# Altium schematic sheet Sheet2.SchDoc
size A4; SheetNumber: 2; SheetTotal: 3
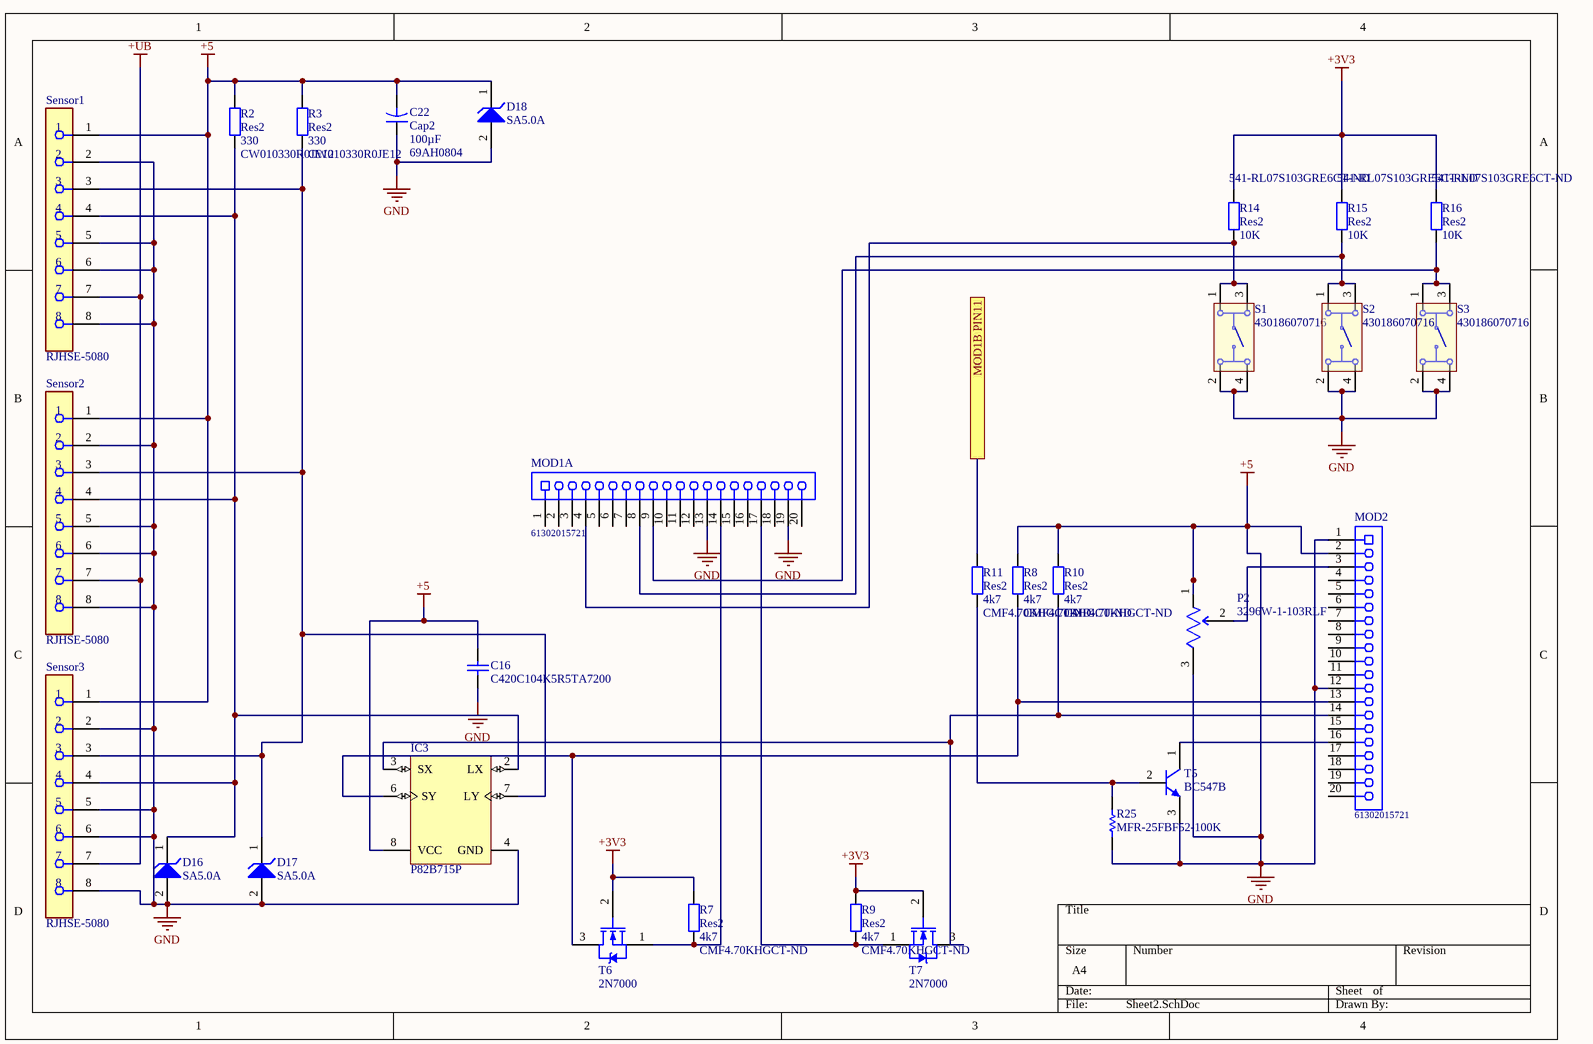
[diagram p0: Sheet2.SchDoc]

## Parts
C16  C420C104K5R5TA7200  [KEMT-C420C104K5R5TA7200-2]
C22  Cap2  value 100µF  Supplier Part Number 1: 69AH0804  [CAPR5-4X5]
D16  SA5.0A  [ONSC-AXIAL_LEAD-2-59AA-01_P]
D17  SA5.0A  [ONSC-AXIAL_LEAD-2-59AA-01_P]
D18  SA5.0A  [ONSC-AXIAL_LEAD-2-59AA-01_P]
IC3  P82B715P  [P0008A]
MOD1A  61302015721  [61302015721]
MOD2  61302015721  [61302015721]
P2  3296W-1-103RLF  [FP-3296W-MFG]
R2  Res2  value 330  Supplier Part Number 1: CW010330R0JE12  [AXIAL-0.4]
R3  Res2  value 330  Supplier Part Number 1: CW010330R0JE12  [AXIAL-0.4]
R7  Res2  value 4k7  Supplier Part Number 1: CMF4.70KHGCT-ND  [AXIAL-0.4]
R8  Res2  value 4k7  Supplier Part Number 1: CMF4.70KHGCT-ND  [AXIAL-0.4]
R9  Res2  value 4k7  Supplier Part Number 1: CMF4.70KHGCT-ND  [AXIAL-0.4]
R10  Res2  value 4k7  Supplier Part Number 1: CMF4.70KHGCT-ND  [AXIAL-0.4]
R11  Res2  value 4k7  Supplier Part Number 1: CMF4.70KHGCT-ND  [AXIAL-0.4]
R14  Res2  value 10K  Supplier Part Number 1: 541-RL07S103GRE6CT-ND  [AXIAL-0.4]
R15  Res2  value 10K  Supplier Part Number 1: 541-RL07S103GRE6CT-ND  [AXIAL-0.4]
R16  Res2  value 10K  Supplier Part Number 1: 541-RL07S103GRE6CT-ND  [AXIAL-0.4]
R25  MFR-25FBF52-100K  [RESA60-630X240]
S1  430186070716  [430186070716]
S2  430186070716  [430186070716]
S3  430186070716  [430186070716]
Sensor1  RJHSE-5080  [FP-RJHSE-5080-MFG]
Sensor2  RJHSE-5080  [FP-RJHSE-5080-MFG]
Sensor3  RJHSE-5080  [FP-RJHSE-5080-MFG]
T5  BC547B  [ONSC-TO-92-3-29-11]
T6  2N7000  [ONSC-TO-92-3-29-11]
T7  2N7000  [ONSC-TO-92-3-29-11]

## Ports
MOD1B PIN11

## Nets
+3V3: R7.2 R9.1 R14.2 R15.2 R16.2 T6.2(G) T7.2(G)
+5: C16.1 C16.2 C22.1 C22.2 D16.2(A) D17.2(A) D18.1(K) D18.2(A) IC3.4(GND) IC3.8(VCC) MOD1A.13 MOD1A.19 MOD2.1 MOD2.2 MOD2.12 P2.1(CCW) P2.3(CW) R2.2 R3.2 R8.1 R10.1 R25.1 S1.2 S1.4 S2.2 S2.4 S3.2 S3.4 Sensor1.1 Sensor1.2 Sensor1.5 Sensor1.6 Sensor1.8 Sensor2.1 Sensor2.2 Sensor2.5 Sensor2.6 Sensor2.8 Sensor3.1 Sensor3.2 Sensor3.5 Sensor3.6 Sensor3.8 T5.3(E)  [also labelled GND]
+UB: Sensor1.7 Sensor2.7 Sensor3.7
MOD1B PIN11: R11.1 ; port MOD1B PIN11
NetD16_1: D16.1(K) IC3.2(LX) R2.1 Sensor1.4 Sensor2.4 Sensor3.4
NetD17_1: D17.1(K) IC3.7(LY) R3.1 Sensor1.3 Sensor2.3 Sensor3.3
NetIC3_3: IC3.3(SX) MOD2.14 R10.2 T7.3(D)
NetIC3_6: IC3.6(SY) MOD2.13 R8.2 T6.3(D)
NetMOD1A_4: MOD1A.4 R14.1 S1.1 S1.3
NetMOD1A_8: MOD1A.8 R15.1 S2.1 S2.3
NetMOD1A_9: MOD1A.9 R16.1 S3.1 S3.3
NetMOD1A_14: MOD1A.14 R7.1 T6.1(S)
NetMOD1A_17: MOD1A.17 R9.2 T7.1(S)
NetMOD2_3: MOD2.3 P2.2(WIPER)
NetMOD2_16: MOD2.16 T5.1(C)
NetR11_2: R11.2 R25.2 T5.2(B)

Not connected (* = marked no-connect by the designer): MOD1A 1 2 3 5 6 7 10 11 12 15 16 18 20; MOD2 4 5 6 7 8 9 10 11 15 17 18 19 20

## Library data of the parts
C16 = CMP-2000-05175-1: CAP, Ceramic, 0.1 uF, +/- 10%, 50 V, -55 to 125 degC, 2-Pin THD, RoHS, Tape and Reel; Manufacturer: KEMET; Capacitance Value: 0.1uF; Dielectric: X7R; Product Diameter: 2.54(Max)mm; Rad Hard: No; Product Length: 6.6(Max)mm; Voltage: 50Vdc; Tolerance: 10%; Package Description: 3-Pin Through Hole Device, Body 7.36 x 2.54 mm, Pitch 11.04 mm; Category: CapacitorCeramicMultilayer; Operating Temperature: -55to125degC; Termination Style: Axial; Manufacturer URL: http://www.kemet.com/; Mounting: ThroughHole; Datasheet URL: http://www.mouser.com/ds/2/212/Kemet_C410-412-420-364989.pdf; Package/Case: 2.54(Max)X6.6(Max); Datasheet Version: Aug-14
C22 = Cap2: Cap Aluminum 100uF 25V 20% (6.3 X 11mm) Radial 5mm 190mA 2500 hr 85C Ammo Pack; Manufacturer: Vishay BCcomponents; Manufacturer Part Number: MAL203836101E3; Life (Hours): 2500Hour; Leakage Current: 25uA; Dissipation Factor: 0.14%; Lead Diameter: 0.5mm; Published: 23-Sep-2002; PackageReference: CAPR5-4X5; Publisher: Altium Limited; PackageDescription: Capacitor; 2 Leads; Supplier 1: Newark; RoHS: Yes; Category: Aluminum Electrolytic Capacitors; Stock 1: 9020; Pricing 1: 10=0,22900, 25=0,22100, 50=0,21300, 100=0,20400 (USD); Mount: Through Hole; Case/Package: Radial; Weight: 0.021164oz; Min Operating Temperature: -40°C; Max Operating Temperature: 85°C; Capacitance: 100uF; Tolerance: 20%; Voltage Rating: 25V; Packaging: Tape and Reel; Ripple Current: 190mA; Termination: Radial; Package Quantity: 10000; Voltage Rating (DC): 25V; Series: 038 RSU; Diameter: 6.3mm; Length: 11mm; Height: 11mm; Height - Seated (Max): 0.492inch; Lead Pitch: 5mm; Radiation Hardening: No; RoHS Compliant: Yes; ComponentLink1URL: https://datasheet.ciiva.com/11701/038rsu-11701167.pdf?src-supplier=Avnet; ComponentLink1Description: https://datasheet.ciiva.com/11701/038rsu-11701167.pdf?src-supplier=Avnet
D16-D18 = CMP-1061-00012-1: 500 W Peak Power, MiniMOSORB(TM) Zener Transient Voltage Suppressor, Unidirectional, 2-Pin Axial_Lead, Bulk Box; Manufacturer: On Semiconductor; V(BR) Typ (V): 6.7; IR Max (uA): 600; PPK Max (W): 500; Mounting Technology: Through Hole; ComponentLink3URL: http://www.onsemi.com/pub_link/Collateral/59AA.PDF; ComponentLink2URL: http://www.onsemi.com/pub_link/Collateral/SA5.0A-D.PDF; Direction: Unidirectional; PackageDescription: 2-Pin, Axial Lead, Diameter 3.1 mm; PackageReference: AXIAL_LEAD-2-59AA-01; PartNumber: SA5.0A; ComponentLink1URL: http://www.onsemi.com/; Packing: Bulk Box; ComponentLink3Description: Package Specification; ComponentLink2Description: Datasheet; PackageVersion: Rev. A, 02/2007; DatasheetVersion: Rev. 13; ComponentLink1Description: Manufacturer URL
IC3 = CMP-0314-00015-2: I2C Bus Extender, 2 Channel Width, 3.0 to 12.0 V, -40 to 85 degC, 8-pin PDIP (P), Pb-Free (RoHS); Manufacturer: Texas Instruments; Master Side I2C Bus Capacitance Supported(pF): 400; VCC(Min)(V): 3; Open Drain I/O Type: Yes; Eco-Plan: Green (RoHS & no Sb/Br); Channel Width: 2; SubFamily: I2C Hub, Buffer, Repeater; VCC(Max)(V): 12; ComponentLink2URL: http://www.ti.com/litv/pdf/mpdi001b; Code_JEDEC: MS-001-BA; Vcc range(V): 3.0 to 12.0; PackageReference: P0008A; ComponentLink2Description: Package Specification; PackageVersion: revE, Apr-2010; Slave Side I2C Bus Capacitance Supported(pF): 400; ComponentLink1Description: Datasheet; Max Frequency(kHz): 400; ComponentLink1URL: http://www.ti.com/general/docs/lit/getliterature.tsp?genericPartNumber=P82B715&fileType=pdf; DatasheetVersion: SCPS145A; PartNumber: P82B715P; PackageDescription: 8-Pin Plastic Dual-In-Line Package, Row Spacing 7.62 mm, Pitch 2.54 mm; 5V Tolerant I/O: Yes; Mounting Technology: Through-hole
MOD1A MOD2 = CMP-1502-01349-1: THT Vertical Socket Header WR-PHD, Pitch 2.54 mm, Single Row, 20 pins; Manufacturer: Wurth Elektronik; Withstanding Voltage: 500VAC; Working Voltage: 250VAC; Rated Current: 3A; Gender: Female; Pitch: 2.54mm; Contact Resistance: 20mOhm; Pin Number: 20; Operating Temperature: -40to125degC; Manufacturer URL: http://www.we-online.de; Datasheet URL: https://katalog.we-online.de/em/datasheet/6130xx15721.pdf; Row Number: Single; Packaging: Tube; Orientation: Vertical; Publisher: WurthElektronik; Package Reference: 61302015721; Mounting Technology: THT; Part Number: 61302015721
P2 = CMP-07234-000024-1: TRIMMER 10K OHM 0.5W PC PIN TOP; Resistance: 10kR; Temperature Coefficient: 100ppm/°C; Power Rating: 500mW; Tolerance: 10%; Number of Turns: 25; Width: 0.19inch; Termination: Pin; Radiation Hardening: No; Contact Plating: Tin; Composition: Cermet; Length: 9.53mm; Height: 0.395inch; Depth: 4.83mm; REACH SVHC: No SVHC; Weight: 0.03oz; Min Operating Temperature: -55°C; Military Standard: Not; Max Operating Temperature: 125°C; Packaging: Tape and Reel; Package Quantity: 1; Taper: Linear; Max Power Dissipation: 500mW; Mount: Through Hole
R2 R3 = Res2: Wirewound Resistors 10watts 330ohms 5%; Manufacturer: Vishay Dale; Resistance: 330R; Power Rating: 10W; Temperature Coefficient: 30ppm/°C; Lead Diameter: 1.02mm; Published: 8-Jun-2000; LatestRevisionDate: 17-Jul-2002; LatestRevisionNote: Re-released for DXP Platform.; PackageReference: AXIAL-0.4; Publisher: Altium Limited; PackageDescription: Axial Device, Thru-Hole; 2 Leads; 0.4 in Pin Spacing; Supplier 1: Avnet; Manufacturer Part Number: CW010330R0JE12; RoHS: Yes; Category: Through-Hole Resistors; Pricing 1: 100=1,22562, 200=1,19564, 400=1,09480, 600=1,06352, 800=1,04006, 1000=1,01660, 10000=0,99314 (USD); Mount: Through Hole; Case/Package: Axial; Weight: 0.317466oz; Contact Plating: Tin,Matte; Min Operating Temperature: -65°C; Max Operating Temperature: 250°C; Tolerance: 5%; Resistor Type: Wirewound; Packaging: Bulk; Package Quantity: 100; Number of Terminations: 2; Termination: Axial; Max Power Dissipation: 10W; Features: Moisture Resistant; Diameter: 9.52mm; Length: 47.62mm; Radiation Hardening: No; Military Standard: Not; ComponentLink1URL: https://datasheet.ciiva.com/8453/cw-8453255.pdf?src-supplier=Avnet; ComponentLink1Description: https://datasheet.ciiva.com/8453/cw-8453255.pdf?src-supplier=Avnet; ComponentLink2URL: https://datasheet.ciiva.com/2761/cw-2761098.pdf?src-supplier=Digi-Key; ComponentLink2Description: https://datasheet.ciiva.com/2761/cw-2761098.pdf?src-supplier=Digi-Key
R7-R11 = Res2: METAL FILM RESISTOR, 4.7KOHM, 500mW, 1%; Product Range:CMF Series; Resistance:4.7kohm; Power Rating:500mW; Resistance Tolerance: 1%; Voltage Rating:250V; Resistor Case Style:Axial Leaded; Resistor Element Type:Metal Film ;RoHS Compliant: Yes; Manufacturer: Vishay Dale; Manufacturer Part Number: CMF554K7000FKEB; Resistance: 4.7kR; Temperature Coefficient: 100ppm/°C; Voltage Rating: 250V; Lead Diameter: 0.64mm; Published: 8-Jun-2000; LatestRevisionDate: 17-Jul-2002; LatestRevisionNote: Re-released for DXP Platform.; PackageReference: AXIAL-0.4; Publisher: Altium Limited; PackageDescription: Axial Device, Thru-Hole; 2 Leads; 0.4 in Pin Spacing; Supplier 1: Digi-Key; RoHS: Yes; Category: Through-Hole Resistors; Stock 1: 1586; Pricing 1: 1=0,53000, 10=0,40700, 25=0,30960, 50=0,23000, 100=0,17110, 250=0,14456, 500=0,12390 (USD); Case/Package: Axial; Number of Pins: 2; Contact Plating: Tin,Matte; Weight: 0.009877oz; Min Operating Temperature: -55°C; Max Operating Temperature: 175°C; Tolerance: 1%; Power Rating: 500mW; Resistor Type: Metal Film; Packaging: Tape and Reel; Package Quantity: 1; Number of Terminations: 2; Max Power Dissipation: 500mW; Termination: Axial; Voltage Rating (DC): 250V; Features: Moisture Resistant,Flame Retardant Coating; Series: CMF; Diameter: 2.29mm; Length: 6.1mm; Width: 2.29mm; REACH SVHC: Unknown; RoHS Compliant: Yes; Lead Free: Lead Free; ComponentLink1URL: https://datasheet.ciiva.com/8821/cmfind-8821141.pdf?src-supplier=Avnet; ComponentLink1Description: https://datasheet.ciiva.com/8821/cmfind-8821141.pdf?src-supplier=Avnet; ComponentLink2URL: https://datasheet.ciiva.com/6532/cmfind-6532695.pdf?src-supplier=Digi-Key; ComponentLink2Description: https://datasheet.ciiva.com/6532/cmfind-6532695.pdf?src-supplier=Digi-Key; ComponentLink3URL: https://datasheet.ciiva.com/6532/cmfind-6532697.pdf?src-supplier=Digi-Key; ComponentLink3Description: https://datasheet.ciiva.com/6532/cmfind-6532697.pdf?src-supplier=Digi-Key; ComponentLink4URL: https://datasheet.ciiva.com/16436/cmfind-16436747.pdf?src-supplier=Future+Electronics; ComponentLink4Description: https://datasheet.ciiva.com/16436/cmfind-16436747.pdf?src-supplier=Future+Electronics
R14-R16 = Res2: Metal Film Resistors 1/4watt 10Kohms 2%; Manufacturer: Vishay Dale; Manufacturer Part Number: RL07S103GRE6; Resistance: 10kR; Max Power Dissipation: 250mW; Temperature Coefficient: 200ppm/°C; Voltage Rating: 250V; Published: 8-Jun-2000; LatestRevisionDate: 17-Jul-2002; LatestRevisionNote: Re-released for DXP Platform.; PackageReference: AXIAL-0.4; Publisher: Altium Limited; PackageDescription: Axial Device, Thru-Hole; 2 Leads; 0.4 in Pin Spacing; Supplier 1: Digi-Key; RoHS: No; Category: Through-Hole Resistors; Stock 1: 976; Pricing 1: 1=0,66000, 10=0,47000, 25=0,36640, 50=0,31020, 100=0,24440, 250=0,20680, 500=0,16920 (USD); Mount: Through Hole; Case/Package: Axial; Contact Plating: Tin,Lead; Min Operating Temperature: -65°C; Max Operating Temperature: 175°C; Tolerance: 2%; Packaging: Tape and Reel; Resistor Type: Metal Film; Number of Terminations: 2; Package Quantity: 1000; Power Rating: 250mW; Series: Military, MIL-PRF-22684/01, RL07; Termination: Axial; Features: Moisture Resistant,Military,Flame Retardant Coating; Diameter: 2.29mm; Length: 0.24inch; Width: 2.29mm; RoHS Compliant: No; Lead Free: Contains Lead; Military Standard: MIL-PRF-22684; ComponentLink1URL: https://datasheet.ciiva.com/14072/cmfmil-14072105.pdf?src-supplier=Digi-Key; ComponentLink1Description: https://datasheet.ciiva.com/14072/cmfmil-14072105.pdf?src-supplier=Digi-Key
R25 = CMP-1659-00073-1: Axial Resistor, 100 KOhm, +/- 1%, 0.25 W, -55 to 155 degC, 2-Pin THD, RoHS, Bulk; Voltage Rating: 250 V; Power Rating: 250 mW; Resistance: 475 Ohm; PackageDescription: 2-Pin Axial Lead, Dia 2.4 mm, Body Length 6.3 mm; PackageReference: MFR-25; Length: 0.248 inch; ComponentLink2Description: Datasheet; Packaging: Bulk; DatasheetVersion: Apr-13; Package Quantity: 200; Min Operating Temperature: -55 degC; ComponentLink2URL: http://www.yageo.com/documents/recent/Yageo%20LR_MFR_2013.pdf; RoHSCompliant: true; ComponentLink1URL: http://www.yageo.com/; Tolerance: 1%; Case\Package: Axial; Mount: Through Hole; ComponentLink1Description: Manufacturer URL; Max Operating Temperature: 155 degC
S1-S3 = CMP-1453-00013-1: WS-TATV THT Tact Switch 6X6 mm; Manufacturer: Wuerth Elektronik; NoPins: 04; PackageReference: 430186070716; ComponentLink2Description: Datasheet; ComponentLink1Description: Manufacturer URL; PartNumber: 430186070716; ComponentLink2URL: http://katalog.we-online.de/em/datasheet/4301x6.pdf; ComponentLink1URL: http://www.we-online.com
Sensor1-Sensor3 = CMP-02366-000003-1: CONN MOD JACK 8P8C R/A UNSHLD; Manufacturer: Amphenol; Current Rating: 1.5A; Voltage Rating: 125V; Pitch: 1.02mm; Conn Orientation: Right Angle; Number Of Contacts: 8; Is Female: yes; Conn Gender: Female; Lead Free: Yes; Device Class L3: unset; Footprint Url: https://cdn.amphenol-icc.com/media/wysiwyg/files/drawing/rjhse5080.pdf?__cf_chl_jschl_tk__=e349db0bbbb6188a39347cd5e541b92fa02c9719-1587748343-0-AW7tChdeHzRPLX9gSWj7WrKaXQoY9BsmT9Ek0h-T62M9y3Rs9iypFcOtkzb-6sGYQEjFE-jcoNciDETCOZrh1rYyOesac5SvYLoLwHIsHvF4AKBlx-MXmfZUVk9OTTJLqyQq2qMm0PFRLJpNcK0nrKResqOniRSYixG2sPTmOPraH-ULJFBDL602CHqcI9KKBgTq90Jh1OL2Td4moJ99rFsJRJ1Tk_uoxGe8ublcP_ARu-uLpWcQrBcwOcHDTAwL29DAwVaqcH7ta8Ks7WMlHmVl_pILeEDwT0bE9vu5Pa5S3PtNRF1leuFkgi_FMbUxTDulc5xzbXSfng8srUIV1lWXny5nx1fZJEUa_w97yKjffzBMxiWLWVN-V7-uqAaPbyv_m-wRyw5O25OZNyJOeGU; ComponentLink2URL: https://cdn.amphenol-icc.com/media/wysiwyg/files/documentation/datasheet/inputoutput/io-modjack-rjhse.pdf; Device Class L1: Connectors; Package: CONN_MOD_JACK; Mouser Description: Modular Connectors / Ethernet Connectors R/A RJ45 NONSHIELDED 8 CONT NO LEDS; Manufacturer Part Number: RJHSE-5080; Octopart: https://octopart.com/rjhse-5080-amphenol-45060; Category: Conn; Height: 0.535inch; Temperature: -55°C to +85°C; Digikey Description: CONN MOD JACK 8P8C R/A UNSHLD; Device Class L2: Modular / Ethernet Connectors; Contact Material: Gold,Nickel; ComponentLink2Description: Datasheet; Temperature Range Low: -55°C; RoHS: TRUE; Automotive: No; Temperature Range High: +85°C
T5 = CMP-1048-01467-1: Amplifier Transistor, NPN Silicon, 3-Pin TO-92, Bulk Box; Manufacturer: On Semiconductor; IC Continuous (A): 0.1; fT Min (MHz): 150; DatasheetVersion: Rev. 7; ComponentLink1URL: http://www.onsemi.com/; Polarity: NPN; RoHS: FALSE; ComponentLink1Description: Manufacturer URL; Packing: Bulk Box; PackageDescription: 3-Pin Transistor Outline, Body 4.825 x 3.685 mm, Pitch 1.27 mm; ComponentLink3URL: http://www.onsemi.cn/pub_link/Collateral/2N6426-D.PDF; ComponentLink2Description: Datasheet; PackageVersion: Rev. AM; PackageReference: TO-92-3-29-11_AM_SL; ComponentLink3Description: Package Specification; Mounting Technology: Through Hole; PartNumber: BC547B; ComponentLink2URL: http://www.onsemi.com/pub_link/Collateral/BC546-D.PDF
T6 T7 = CMP-1058-00936-1: Small Signal MOSFET, 200 mA, 60 V, N-Channel, 3-Pin TO-92, Bulk Box; Manufacturer: On Semiconductor; Ciss Typ (pF): 60; VGS(th) Max (V): 3; Crss Typ (pF): 5; Channel Polarity: N Channel; VGS Max (V): 20; Configuration: Single; PD Max (W): 0.35; Coss Typ (pF): 25; ID Max (A): 0.2; PackageVersion: Rev. AM; ComponentLink3URL: http://www.onsemi.cn/pub_link/Collateral/2N6426-D.PDF; ComponentLink2URL: http://www.onsemi.com/pub_link/Collateral/2N7000-D.PDF; DatasheetVersion: Rev. 8; Mounting Technology: Through Hole; V(BR)DSS Min (V): 60; PartNumber: 2N7000; PackageDescription: 3-Pin Transistor Outline, Body 4.825 x 3.685 mm, Pitch 1.27 mm; ComponentLink2Description: Datasheet; ComponentLink1URL: http://www.onsemi.com/; PackageReference: TO-92-3-29-11_AM_SL; Packing: Bulk Box; ComponentLink1Description: Manufacturer URL; Package Type: TO-92; ComponentLink3Description: Package Specification